# EAGLE design atmduinoboard (EAGLE 7.2.0)
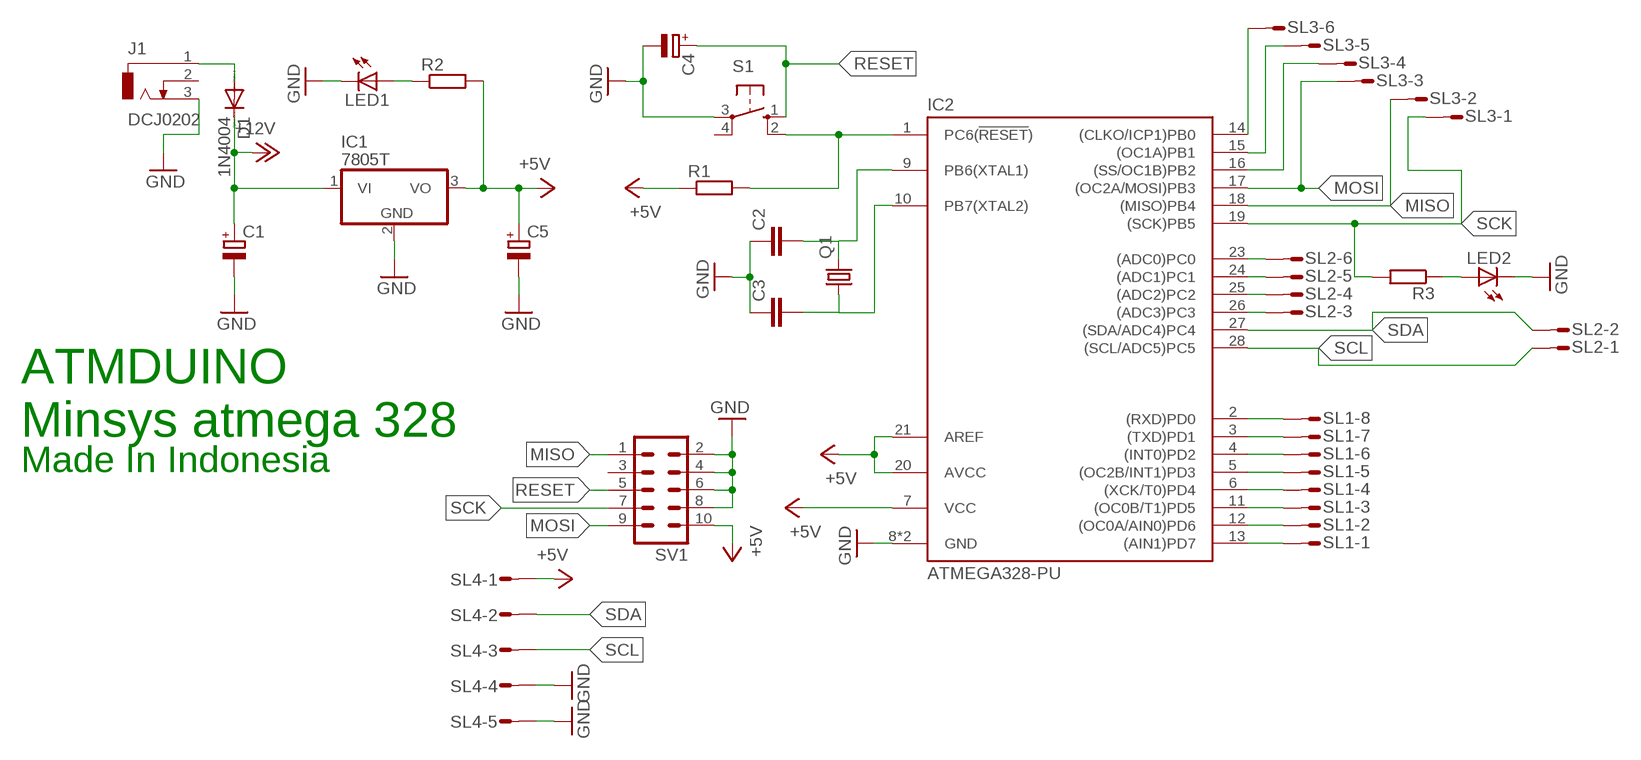
[diagram p0: schematic, sheet 1]

## Parts
C1  CPOL-EUE2-4  [E2-4]
C2  C-EU025-024X044  [C025-024X044]
C3  C-EU025-024X044  [C025-024X044]
C4  CPOL-EUE2-4  [E2-4]
C5  CPOL-EUE2-4  [E2-4]
D1  1N4004  [DO41-10]
IC1  7805T  [TO220H]
IC2  ATMEGA328-PU  [DIL28]
J1  DCJ0202  [DCJ0202]
LED1  LED3MM  [LED3MM]
LED2  LED3MM  [LED3MM]
Q1  CRYSTALHC49U-V  [HC49U-V]
R1  R-EU_0204/5  [0204/5]
R2  R-EU_0204/5  [0204/5]
R3  R-EU_0204/5  [0204/5]
S1  10-XX  [B3F-10XX]
SL1  M08S  [08P]
SL2  M06S  [06P]
SL3  M06S  [06P]
SL4  M06S  [06P]
SV1  ML10  [ML10]

## Nets
+5V: C5.+ IC1.3(VO) IC2.7(VCC) IC2.20(AVCC) IC2.21(AREF) R1.1 R2.2 SL4.1 SV1.10
+12V: C1.+ D1.C IC1.1(VI)
GND: C1.- C2.1 C3.1 C4.- C5.- IC1.2(GND) IC2.8(GND) IC2.22(GND) J1.3 LED1.K(C) LED2.K(C) S1.3(P) SL4.4 SL4.5 SV1.2 SV1.4 SV1.6 SV1.8
MISO: IC2.18((MISO)PB4) SL3.2 SV1.1
MOSI: IC2.17((OC2A/MOSI)PB3) SL3.3 SV1.9
N$3: LED1.A R2.1
N$4: LED2.A R3.1
N$5: IC2.2((RXD)PD0) SL1.8
N$6: IC2.1(PC6(!RESET!)) R1.2 S1.2(S1)
N$7: IC2.3((TXD)PD1) SL1.7
N$8: C2.2 IC2.9(PB6(XTAL1)) Q1.2
N$9: C3.2 IC2.10(PB7(XTAL2)) Q1.1
N$10: IC2.4((INT0)PD2) SL1.6
N$11: IC2.5((OC2B/INT1)PD3) SL1.5
N$12: IC2.6((XCK/T0)PD4) SL1.4
N$13: IC2.11((OC0B/T1)PD5) SL1.3
N$14: IC2.12((OC0A/AIN0)PD6) SL1.2
N$15: IC2.13((AIN1)PD7) SL1.1
N$16: IC2.23((ADC0)PC0) SL2.6
N$17: IC2.24((ADC1)PC1) SL2.5
N$18: IC2.26((ADC3)PC3) SL2.3
N$19: IC2.25((ADC2)PC2) SL2.4
N$20: D1.A J1.1
N$22: IC2.14((CLKO/ICP1)PB0) SL3.6
N$23: IC2.15((OC1A)PB1) SL3.5
N$24: IC2.16((SS/OC1B)PB2) SL3.4
RESET: C4.+ S1.1(S) SV1.5
SCK: IC2.19((SCK)PB5) R3.2 SL3.1 SV1.7
SCL: IC2.28((SCL/ADC5)PC5) SL2.1 SL4.3
SDA: IC2.27((SDA/ADC4)PC4) SL2.2 SL4.2
Unconnected: J1.2 S1.4(P1) SL4.6 SV1.3

## Notes on the sheet
- ATMDUINO
- Minsys atmega 328
- Made In Indonesia

## Library data of the parts
C1 C4 C5 = resistor:CPOL-EU: POLARIZED CAPACITOR, European symbol
C2 C3 = resistor:C-EU: CAPACITOR, European symbol
D1 = diode:1N4004: DIODE general purpose rectifier, 1 A
IC1 = linear:78*: Positive VOLTAGE REGULATOR Source: http://cache.national.com/ds/LM/LM78L05.pdf http://www.fairchildsemi.com/ds/LM/LM7805.pdf
IC2 = ATMEGA328-PU:ATMEGA328-PU: Atmel ATmega48/88/168/328 AVR Microcontroller; AVAILABILITY: Good; DESCRIPTION: ATmega Series 20 MHz 32 KB Flash 2 KB SRAM 8-Bit Microcontroller - DIP-28; MF: Microchip; MP: ATMEGA328-PU; PACKAGE: PDIP-28 Microchip; PRICE: 1.95 USD
J1 = con-jack:DCJ0202: DC POWER JACK Source: DCJ0202.pdf; OC_FARNELL: unknown; OC_NEWARK: unknown
LED1 LED2 = led:LED: LED OSRAM: - CHIPLED LG R971, LG N971, LY N971, LG Q971, LY Q971, LO R971, LY R971 LH N974, LH R974 LS Q976, LO Q976, LY Q976 LO Q996 - Hyper CHIPLED LW Q18S LB Q993, LB Q99A, LB R99A - SideLED LS A670, LO A670, LY A670, LG A670, LP A670 LB A673, LV A673, LT A673, LW A673 LH A674 LY A675 LS A676, LA A676, LO A676, LY A676, LW A676 LS A679, LY A679, LG A679 - Hyper Micro SIDELED® LS Y876, LA Y876, LO Y876, LY Y876 LT Y87S - SmartLED LW L88C, LW L88S LB L89C, LB L89S, LG L890 LS L89K, LO L89K, LY L89K LS L896, LA L896, LO L896, LY L896 - TOPLED LS T670, LO T670, LY T670, LG T670, LP T670 LSG T670, LSP T670, LSY T670, LOP T670, LYG T670 LG T671, LOG T671, LSG T671 LB T673, LV T673, LT T673, LW T673 LH T674 LS T676, LA T676, LO T676, LY T676, LB T676, LH T676, LSB T676, LW T676 LB T67C, LV T67C, LT T67C, LS T67K, LO T67K, LY T67K, LW E67C LS E67B, LA E67B, LO E67B, LY E67B, LB E67C, LV E67C, LT E67C LW T67C LS T679, LY T679, LG T679 LS T770, LO T770, LY T770, LG T770, LP T770 LB T773, LV T773, LT T773, LW T773 LH T774 LS E675, LA E675, LY E675, LS T675 LS T776, LA T776, LO T776, LY T776, LB T776 LHGB T686 LT T68C, LB T68C - Hyper Mini TOPLED® LB M676 - Mini TOPLED Santana® LG M470 LS M47K, LO M47K, LY M47K Source: http://www.osram.convergy.de LUXEON: - LUMILED® LXK2-PW12-R00, LXK2-PW12-S00, LXK2-PW14-U00, LXK2-PW14-V00 LXK2-PM12-R00, LXK2-PM12-S00, LXK2-PM14-U00 LXK2-PE12-Q00, LXK2-PE12-R00, LXK2-PE12-S00, LXK2-PE14-T00, LXK2-PE14-U00 LXK2-PB12-K00, LXK2-PB12-L00, LXK2-PB12-M00, LXK2-PB14-N00, LXK2-PB14-P00, LXK2-PB14-Q00 LXK2-PR12-L00, LXK2-PR12-M00, LXK2-PR14-Q00, LXK2-PR14-R00 LXK2-PD12-Q00, LXK2-PD12-R00, LXK2-PD12-S00 LXK2-PH12-R00, LXK2-PH12-S00 LXK2-PL12-P00, LXK2-PL12-Q00, LXK2-PL12-R00 Source: www.luxeon.com KINGBRIGHT: KA-3528ASYC Source: www.kingbright.com
Q1 = crystal:CRYSTAL: CRYSTAL; OC_FARNELL: 1666969; OC_NEWARK: unknown
R1-R3 = resistor:R-EU_: RESISTOR, European symbol
S1 = switch-omron:10-XX: OMRON SWITCH; MPN: B3F-1000; OC_FARNELL: 176432; OC_NEWARK: 36M3542
SL1 = con-amp-quick:M08S: AMP QUICK CONNECTOR; OC_FARNELL: unknown; OC_NEWARK: unknown
SL2-SL4 = con-amp-quick:M06S: AMP QUICK CONNECTOR; OC_FARNELL: unknown; OC_NEWARK: unknown
SV1 = con-ml:ML10: HARTING; OC_FARNELL: unknown; OC_NEWARK: unknown

## Board
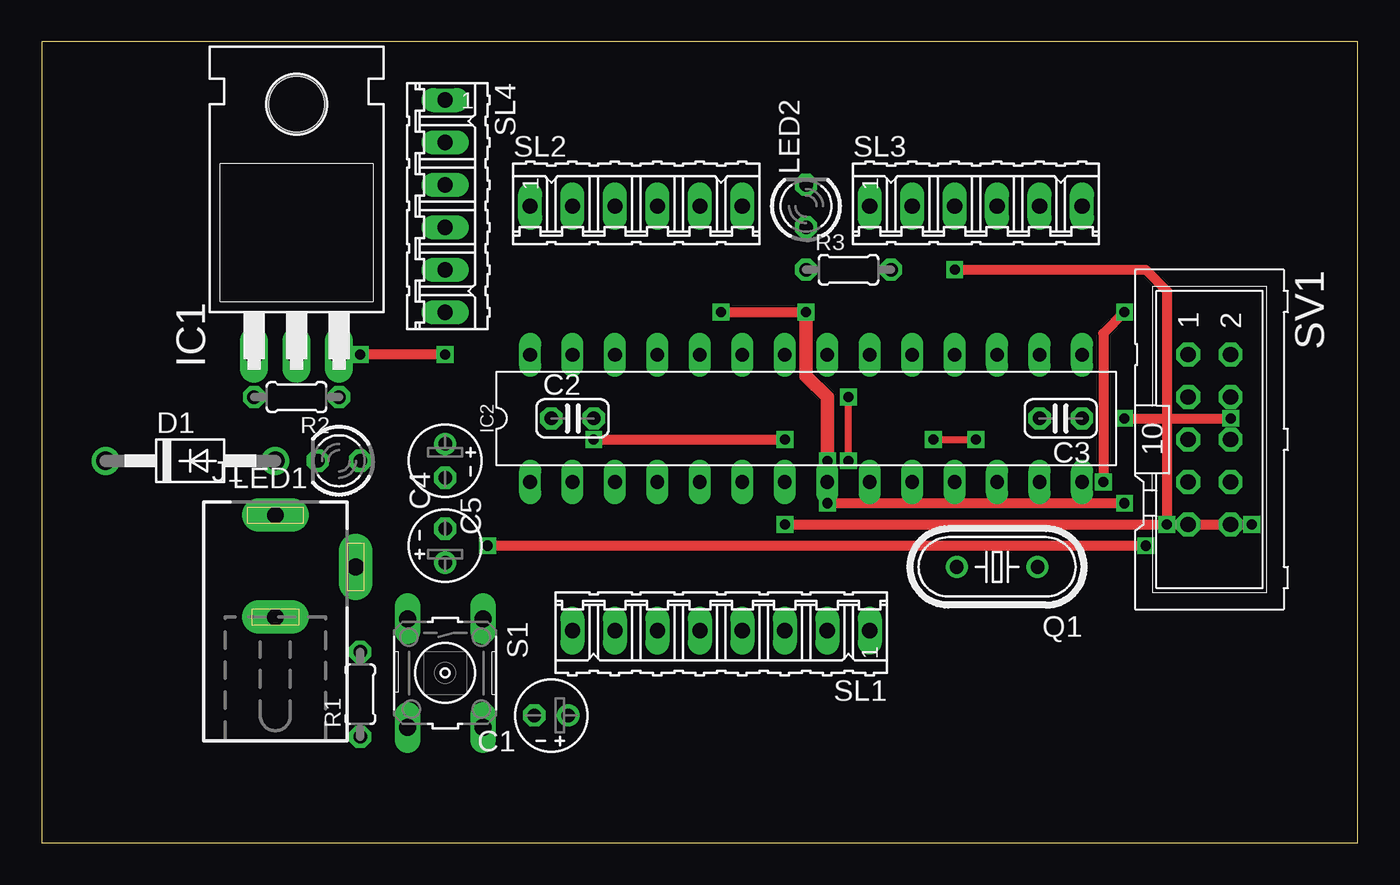
[diagram p1: board, top side]
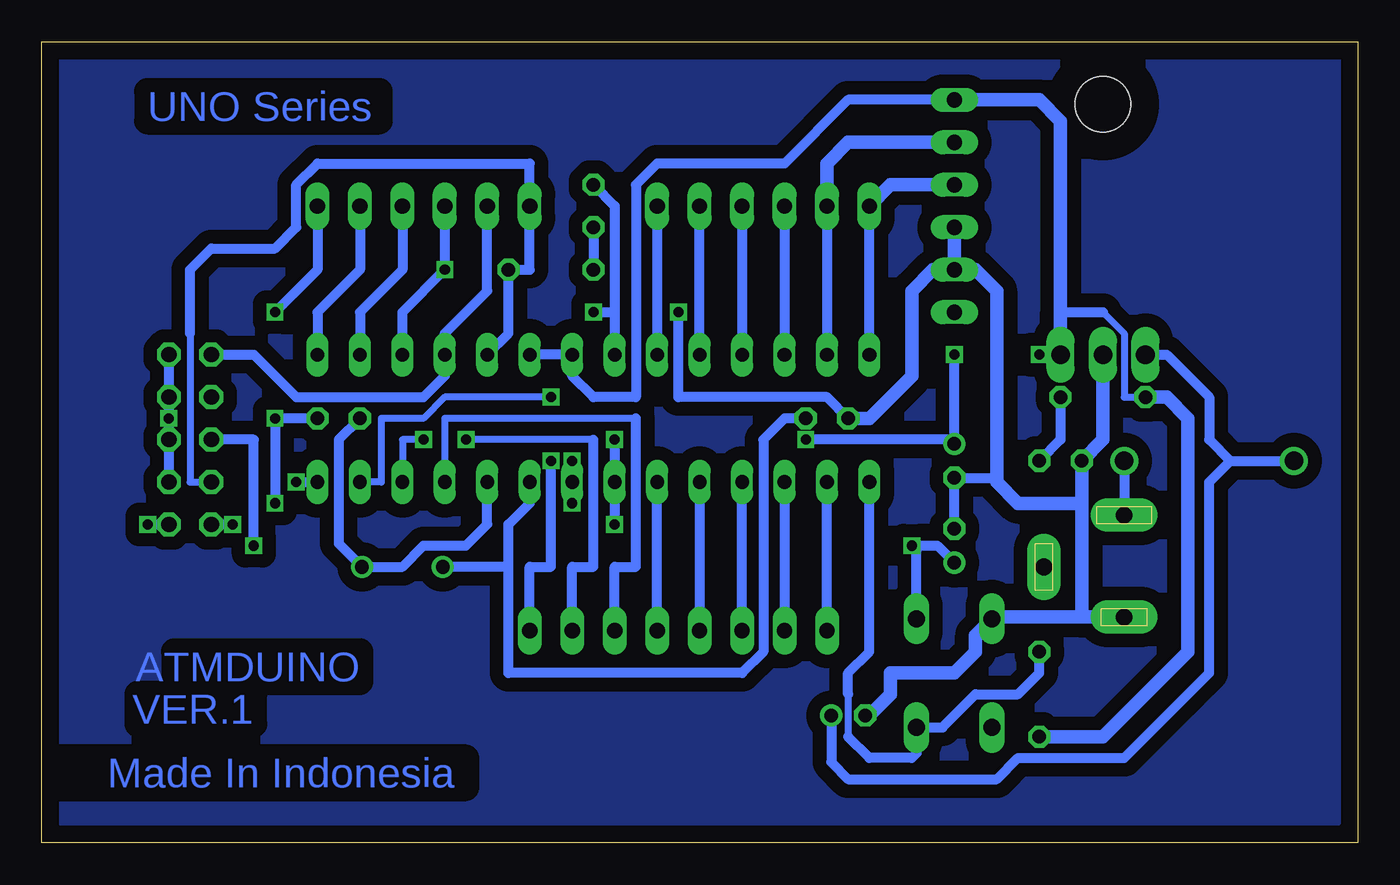
[diagram p2: board, bottom side, seen from below]

Size 78.72 x 47.93 mm. Coordinates in mm from the lower left corner, seen from the top.
Outline: 0,0 78.72,0 78.72,47.93 0,47.93 0,0
Copper layers (1*16): Top 0.035mm / dielectric 1.5mm / Bottom 0.035mm
Design rules "default": minimum track width 10mil, minimum drill 24mil, track to track 8mil, track to pad 8mil, pad to pad 8mil, via to via 8mil, smd to smd 8mil, copper to edge 40mil, drill to drill 8mil, minimum pad ring 10mil, minimum via ring 8mil, stop-mask expansion 4mil, vias tented up to drill 0mil, thermal gap 10mil

### Footprints (pad centres in the part's own frame; a part is rotated, then mirrored left to right if it is on the bottom)
E2-4 = drill 0.813 pad 1.27: + -1.016,0 | drill 0.813 pad 1.27 octagon: - 1.016,0
C025-024X044 = drill 0.813 octagon: 1 -1.27,0; 2 1.27,0
DO41-10 = drill 1.118: A 5.08,0; C -5.08,0
TO220H = drill 1.118 long: 1 -2.54,-10.16; 2 0,-10.16; 3 2.54,-10.16 | hole 3.302: 0,4.826
DIL28 = drill 0.813 long: 1 -3.81,16.51; 2 -3.81,13.97; 3 -3.81,11.43; 4 -3.81,8.89; 5 -3.81,6.35; 6 -3.81,3.81; 7 -3.81,1.27; 8 -3.81,-1.27; 9 -3.81,-3.81; 10 -3.81,-6.35; 11 -3.81,-8.89; 12 -3.81,-11.43; 13 -3.81,-13.97; 14 -3.81,-16.51; 15 3.81,-16.51; 16 3.81,-13.97; 17 3.81,-11.43; 18 3.81,-8.89; 19 3.81,-6.35; 20 3.81,-3.81; 21 3.81,-1.27; 22 3.81,1.27; 23 3.81,3.81; 24 3.81,6.35; 25 3.81,8.89; 26 3.81,11.43; 27 3.81,13.97; 28 3.81,16.51
DCJ0202 = drill 1 pad 2 long: 1 0,3.1; 2 4.8,0; 3 0,-3
LED3MM = drill 0.813 octagon: A -1.27,0; K 1.27,0
HC49U-V = drill 0.813: 1 -2.413,0; 2 2.413,0
0204/5 = drill 0.813 octagon: 1 -2.54,0; 2 2.54,0
B3F-10XX = drill 1.016 long: 1 -3.251,2.261; 2 3.251,2.261; 3 -3.251,-2.261; 4 3.251,-2.261
08P = drill 0.914 long: 1 -8.89,0; 2 -6.35,0; 3 -3.81,0; 4 -1.27,0; 5 1.27,0; 6 3.81,0; 7 6.35,0; 8 8.89,0
06P = drill 0.914 long: 1 -6.35,0; 2 -3.81,0; 3 -1.27,0; 4 1.27,0; 5 3.81,0; 6 6.35,0
ML10 = drill 0.914 octagon: 1 -5.08,-1.27; 2 -5.08,1.27; 3 -2.54,-1.27; 4 -2.54,1.27; 5 0,-1.27; 6 0,1.27; 7 2.54,-1.27; 8 2.54,1.27; 9 5.08,-1.27; 10 5.08,1.27

### Placement (x,y rotation side)
C1  30.48,7.62 180 top
C2  31.75,25.4 0 top
C3  60.96,25.4 180 top
C4  24.13,17.78 90 top
C5  24.13,22.86 270 top
D1  8.89,22.86 0 top
IC1  15.24,39.37 0 top
IC2  45.72,25.4 90 top
J1  13.97,16.51 0 top
LED1  17.78,22.86 180 top
LED2  45.72,38.1 90 top
Q1  57.15,16.51 180 top
R1  19.05,8.89 90 top
R2  15.24,26.67 180 top
R3  48.26,34.29 0 top
S1  24.13,10.16 270 top
SL1  40.64,12.7 180 top
SL2  35.56,38.1 0 top
SL3  55.88,38.1 0 top
SL4  24.13,38.1 270 top
SV1  69.85,24.13 270 top

### Tracks (layer width: path | path; a pad name or v marks a point on that pad's centre or on a via)
+5V  (via drill 0.6)
  Top 0.61: v24.13,29.21 v19.05,29.21 | v33.02,24.13 v44.45,24.13 | v44.45,19.05 v72.39,19.05
  Bottom 0.406: 15.24,31.75 13.97,30.48 13.97,26.67 R2.2
  Bottom 0.61: 17.78,31.75 15.24,31.75 | SL4.1 30.48,44.45 34.29,40.64 41.91,40.64 43.18,39.37 43.18,26.67 45.72,26.67 46.99,27.94 IC2.21 IC2.20 | v19.05,29.21 IC1.3 | v24.13,29.21 C5.+ 24.13,24.13 v33.02,24.13 | v44.45,24.13 IC2.7 v44.45,19.05 | v72.39,19.05 SV1.10
  Bottom 0.813: R1.1 15.24,6.35 10.16,11.43 10.16,25.4 11.43,26.67 R2.2 | SL4.1 19.05,44.45 17.78,43.18 17.78,31.75 IC1.3
+12V
  Bottom 0.61: C1.+ 31.5,4.83 30.48,3.81 21.59,3.81 20.32,5.08 13.97,5.08 8.89,10.16 8.89,21.59 7.62,22.86 | 7.62,22.86 D1.C | IC1.1 11.43,29.21 8.89,26.67 8.89,24.13 7.62,22.86
GND  (via drill 0.6)
  Top 0.61: v40.64,31.75 v45.72,31.75 | v64.77,25.4 v71.12,25.4 | v64.77,20.32 v46.99,20.32
  Top 0.813: v46.99,22.86 46.99,26.67 45.72,27.94 v45.72,31.75
  Bottom 0.61: LED2.K 44.45,38.1 44.45,31.75 | 44.45,31.75 IC2.22 | SV1.2 SV1.4 v71.12,25.4 SV1.6 SV1.8 | v45.72,31.75 44.45,31.75 | v40.64,31.75 40.64,26.67 31.75,26.67 C2.1 | C4.- C5.- 21.84,21.84 21.59,21.59 | C3.1 v64.77,25.4 v64.77,20.32 | v46.99,20.32 IC2.8
  Bottom 0.813: C1.- 29.21,7.62 27.94,8.89 27.94,10.16 24.13,10.16 22.86,11.43 22.86,12.42 S1.3 21.77,13.51 16.51,13.51 | SL4.4 SL4.5 | SL4.5 25.4,34.29 26.67,33.02 26.67,27.94 29.21,25.4 C2.1 | SL4.5 22.86,34.29 21.59,33.02 21.59,21.59 20.32,20.32 16.51,20.32 | 16.51,20.32 16.51,13.51 | IC1.2 15.24,24.13 LED1.K 16.51,20.32 | J1.3 16.51,13.51 | IC2.8 v46.99,22.86
MISO
  Bottom 0.61: SV1.1 66.04,29.21 63.5,26.67 55.88,26.67 54.61,27.94 IC2.18 54.61,30.48 52.07,33.02 SL3.2
MOSI  (via drill 0.6)
  Top 0.61: v54.61,34.29 66.04,34.29 67.31,33.02 v67.31,19.05
  Bottom 0.61: SL3.3 v54.61,34.29 57.15,31.75 IC2.17 | v67.31,19.05 SV1.9
N$1
  pour Bottom (isolate 0.813): 1.27,46.99 77.47,46.99 77.47,1.27 1.27,1.27
N$3
  Bottom 0.61: R2.1 17.78,24.13 LED1.A
N$4
  Bottom 0.61: LED2.A R3.1
N$5
  Bottom 0.61: SL1.8 IC2.2
N$6
  Bottom 0.406: 30.48,8.89 30.48,6.35
  Bottom 0.61: 30.48,6.35 29.21,5.08 26.67,5.08 26.39,5.36 S1.2 24.84,6.91 22.86,8.89 20.32,8.89 19.05,10.16 R1.2 | 30.48,8.89 30.48,10.16 29.21,11.43 IC2.1
N$7
  Bottom 0.61: IC2.3 SL1.7
N$8
  Bottom 0.61: 50.8,16.51 50.8,10.16 36.83,10.16 35.56,11.43 35.56,24.13 34.29,25.4 C2.2 | 50.8,16.51 Q1.2 | 50.8,16.51 50.8,19.05 49.53,20.32 IC2.9
N$9
  Bottom 0.61: IC2.10 52.07,19.05 53.34,17.78 55.88,17.78 57.15,16.51 Q1.1 60.96,17.91 60.96,24.13 C3.2
N$10
  Bottom 0.61: SL1.6 IC2.4
N$11
  Bottom 0.61: IC2.5 SL1.5
N$12
  Bottom 0.61: SL1.4 IC2.6
N$13
  Bottom 0.406: 43.18,25.4 54.61,25.4 IC2.11
  Bottom 0.61: SL1.3 44.45,16.51 43.18,16.51 43.18,25.4
N$14  (via drill 0.6)
  Top 0.406: v53.34,24.13 v55.88,24.13
  Bottom 0.406: 45.72,24.13 v53.34,24.13 | v55.88,24.13 57.15,24.13 IC2.12
  Bottom 0.61: SL1.2 46.99,16.51 45.72,16.51 45.72,24.13
N$15  (via drill 0.6)
  Top 0.406: v48.26,22.86 v48.26,26.67
  Bottom 0.406: 48.26,17.78 v48.26,22.86 | v48.26,26.67 54.61,26.67 55.88,25.4 58.42,25.4 58.42,21.59 IC2.13
  Bottom 0.61: SL1.1 49.53,16.51 48.26,16.51 v48.26,22.86
N$16
  Bottom 0.61: SL2.6 IC2.23
N$17
  Bottom 0.61: IC2.24 SL2.5
N$18
  Bottom 0.61: SL2.3 IC2.26
N$19
  Bottom 0.61: SL2.4 IC2.25
N$20
  Bottom 0.61: D1.A J1.1
N$22  (via drill 0.6)
  Top 0.61: v64.77,31.75 63.5,30.48 v63.5,21.59
  Bottom 0.61: SL3.6 62.23,34.29 v64.77,31.75 | v63.5,21.59 IC2.14
N$23
  Bottom 0.61: SL3.5 59.69,34.29 62.23,31.75 IC2.15
N$24
  Bottom 0.61: SL3.4 57.15,34.29 59.69,31.75 IC2.16
RESET  (via drill 0.6)
  Top 0.61: v26.67,17.78 v66.04,17.78
  Bottom 0.61: v66.04,17.78 66.04,24.13 SV1.5 | C4.+ 25.15,17.78 v26.67,17.78 26.39,17.5 S1.1
SCK
  Bottom 0.406: 69.85,30.48 69.85,21.59 SV1.7
  Bottom 0.61: IC2.19 50.8,30.48 R3.2 49.53,34.29 SL3.1 49.53,40.64 62.23,40.64 63.5,39.37 63.5,36.83 64.77,35.56 68.58,35.56 69.85,34.29 69.85,30.48
SCL
  Bottom 0.61: IC2.28 SL2.1
  Bottom 0.813: SL4.3 27.94,39.37 SL2.1
SDA
  Bottom 0.61: SL2.2 IC2.27
  Bottom 0.813: SL4.2 30.48,41.91 31.75,40.64 SL2.2

### Text on the board
Bottom: UNO Series | ATMDUINO | VER.1 | Made In Indonesia